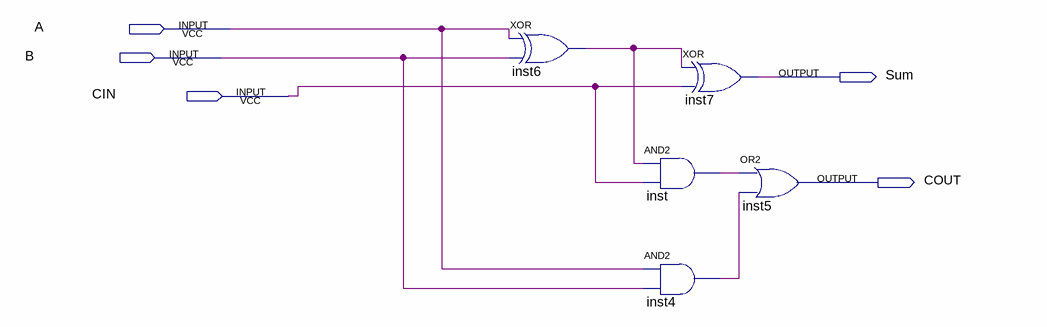
[diagram p0: schematic sheet]
// Quartus schematic HW6_1.bdf as structural Verilog: 5 symbols, 5 pins
module HW6_1 (
  input  A,
  input  B,
  input  CIN,
  output Sum,
  output COUT
);

  wire inst4_out, inst6_out, inst_out;

  xor inst6 (inst6_out, A, B);
  and inst (inst_out, inst6_out, CIN);
  and inst4 (inst4_out, A, B);
  xor inst7 (Sum, inst6_out, CIN);
  or inst5 (COUT, inst_out, inst4_out);
endmodule
